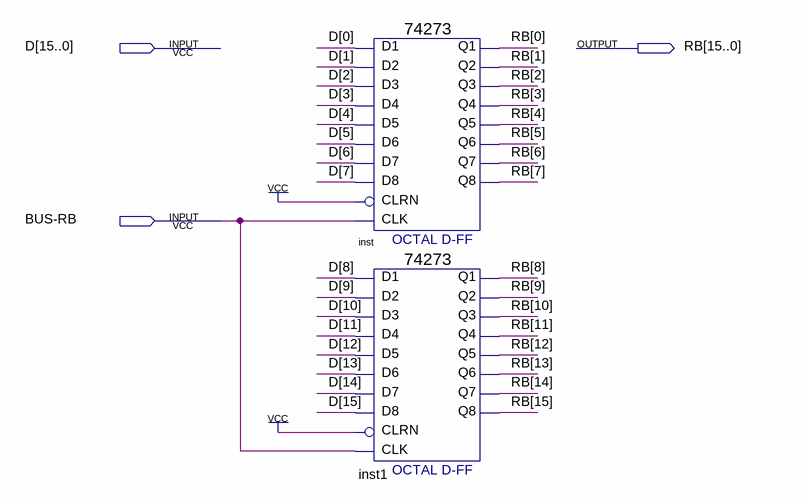
[diagram p0: schematic sheet]
// Quartus schematic ALU_RB.bdf as structural Verilog: 2 symbols, 3 pins
module ALU_RB (
  input  [15:0] D,
  input  \BUS-RB ,
  output [15:0] RB
);

  \74273  inst (
    .D2(D[1]), .D3(D[2]), .D1(D[0]), .D4(D[3]), .D7(D[6]), .D6(D[5]), .D5(D[4]), .D8(D[7]), .CLK(\BUS-RB ),
    .CLRN(1'b1), .Q4(RB[3]), .Q1(RB[0]), .Q2(RB[1]), .Q3(RB[2]), .Q6(RB[5]), .Q5(RB[4]), .Q7(RB[6]),
    .Q8(RB[7]));
  \74273  inst1 (
    .D2(D[9]), .D3(D[10]), .D1(D[8]), .D4(D[11]), .D7(D[14]), .D6(D[13]), .D5(D[12]), .D8(D[15]),
    .CLK(\BUS-RB ), .CLRN(1'b1), .Q4(RB[11]), .Q1(RB[8]), .Q2(RB[9]), .Q3(RB[10]), .Q6(RB[13]), .Q5(RB[12]),
    .Q7(RB[14]), .Q8(RB[15]));
endmodule
